# EAGLE schematic controller_board (EAGLE 9.6.2)
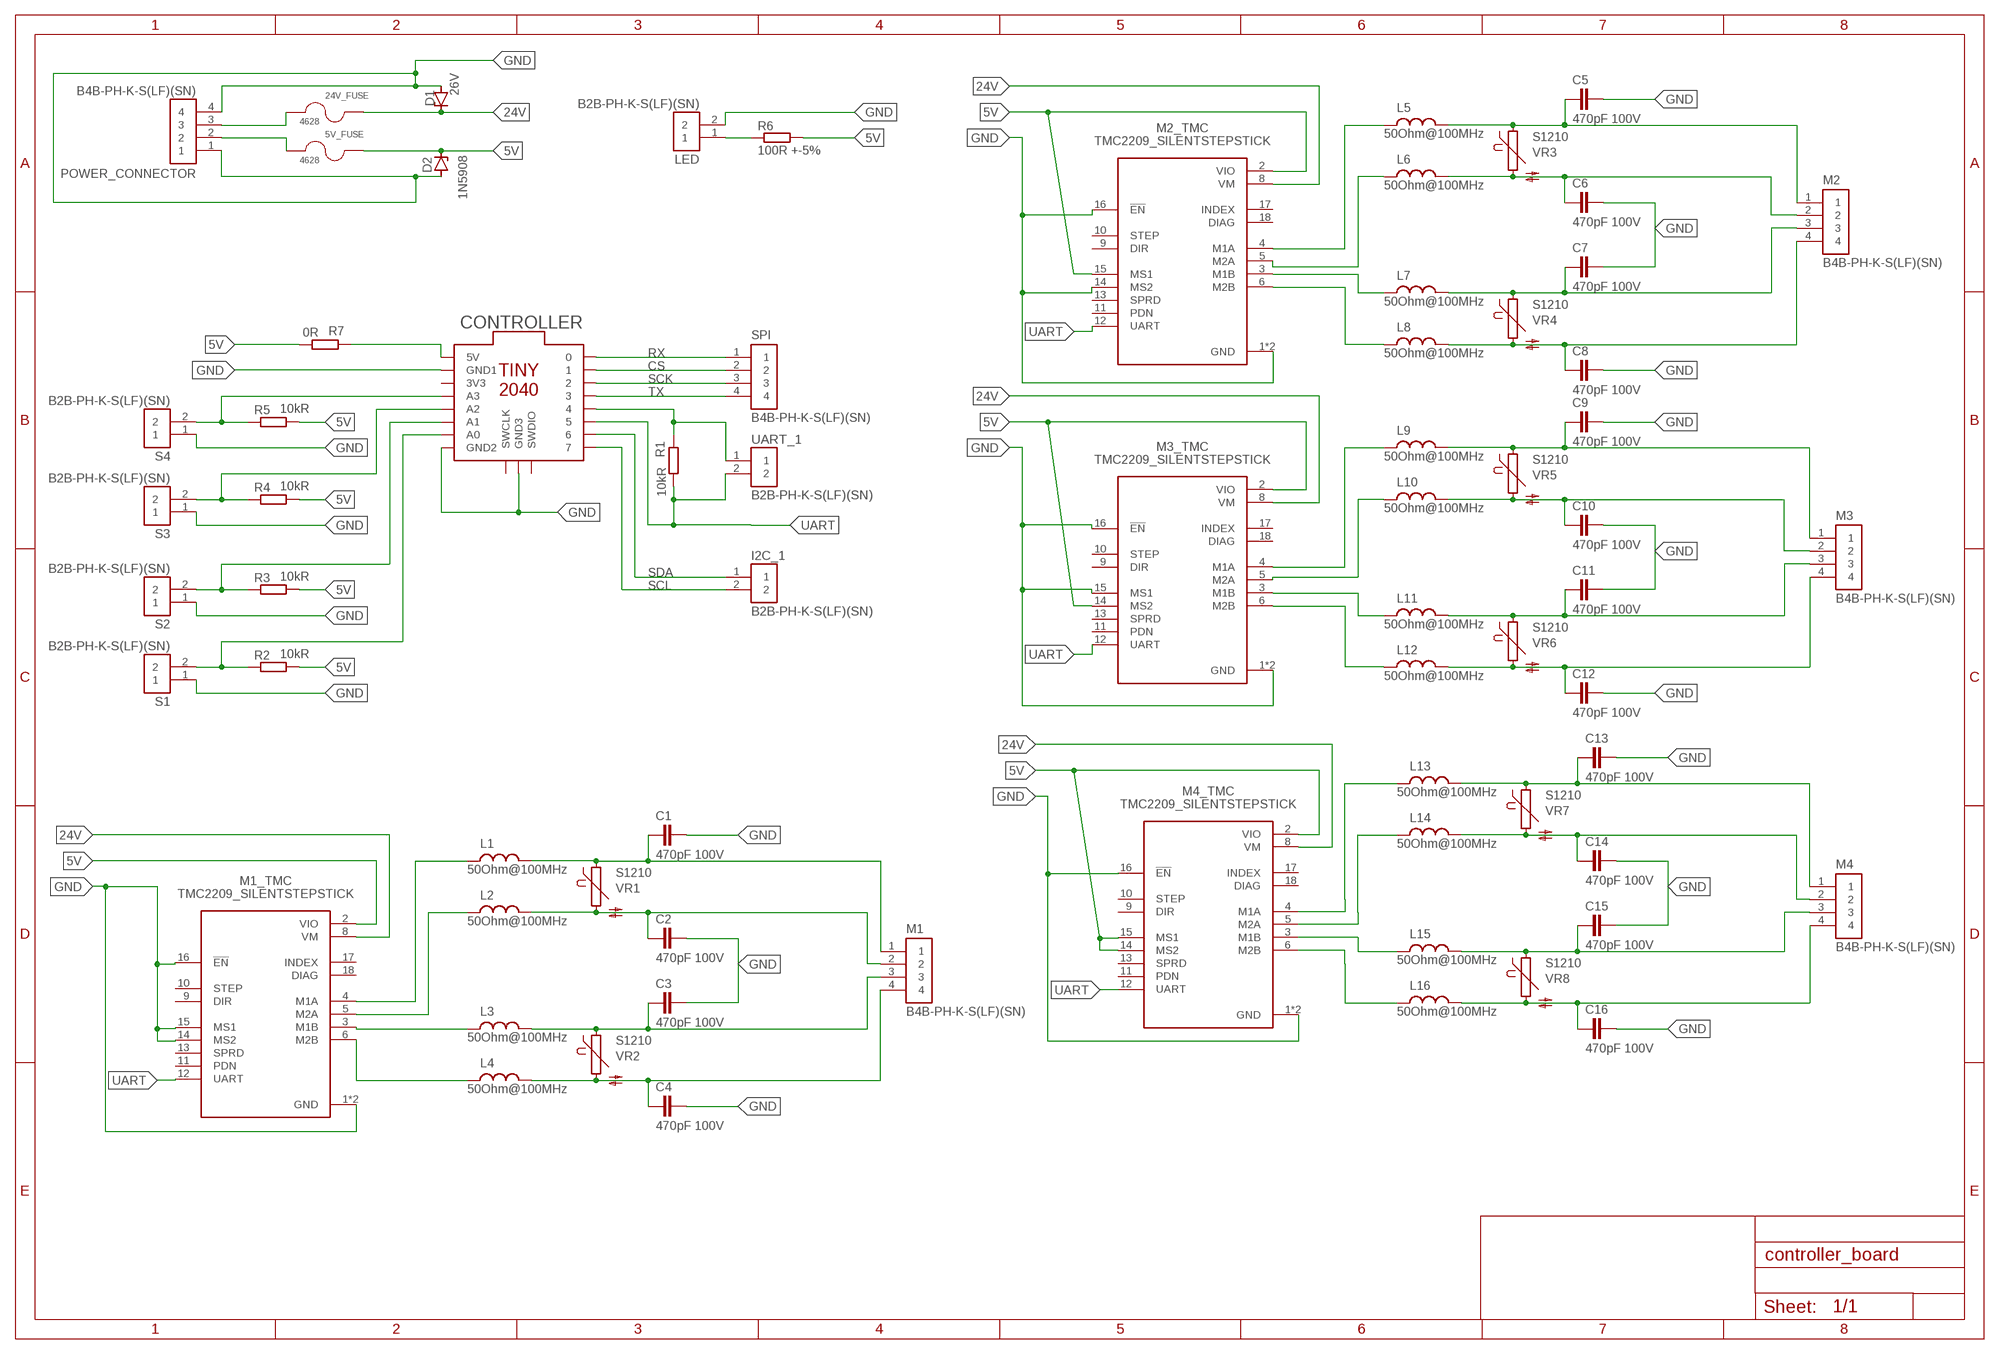
[diagram p0: schematic, sheet 1]

## Parts
5V_FUSE  4628  [FUSE_4628]
24V_FUSE  4628  [FUSE_4628]
C1  470pF 100V  C-EUC0402  [C0402]
C2  470pF 100V  C-EUC0402  [C0402]
C3  470pF 100V  C-EUC0402  [C0402]
C4  470pF 100V  C-EUC0402  [C0402]
C5  470pF 100V  C-EUC0402  [C0402]
C6  470pF 100V  C-EUC0402  [C0402]
C7  470pF 100V  C-EUC0402  [C0402]
C8  470pF 100V  C-EUC0402  [C0402]
C9  470pF 100V  C-EUC0402  [C0402]
C10  470pF 100V  C-EUC0402  [C0402]
C11  470pF 100V  C-EUC0402  [C0402]
C12  470pF 100V  C-EUC0402  [C0402]
C13  470pF 100V  C-EUC0402  [C0402]
C14  470pF 100V  C-EUC0402  [C0402]
C15  470pF 100V  C-EUC0402  [C0402]
C16  470pF 100V  C-EUC0402  [C0402]
CONTROLLER  TINY2040_HEADER  [TINY2040_HEADER]
D1  26V  ZENER-DIODESMB  [SMB]
D2  1N5908  ZENER-DIODESMB  [SMB]
I2C_1  B2B-PH-K-S(LF)(SN)  [JST_B2B-PH-K-S(LF)(SN)]
L1  50Ohm@100MHz  L  (no package)
L2  50Ohm@100MHz  L  (no package)
L3  50Ohm@100MHz  L  (no package)
L4  50Ohm@100MHz  L  (no package)
L5  50Ohm@100MHz  L  (no package)
L6  50Ohm@100MHz  L  (no package)
L7  50Ohm@100MHz  L  (no package)
L8  50Ohm@100MHz  L  (no package)
L9  50Ohm@100MHz  L  (no package)
L10  50Ohm@100MHz  L  (no package)
L11  50Ohm@100MHz  L  (no package)
L12  50Ohm@100MHz  L  (no package)
L13  50Ohm@100MHz  L  (no package)
L14  50Ohm@100MHz  L  (no package)
L15  50Ohm@100MHz  L  (no package)
L16  50Ohm@100MHz  L  (no package)
LED  B2B-PH-K-S(LF)(SN)  [JST_B2B-PH-K-S(LF)(SN)]
M1  B4B-PH-K-S(LF)(SN)  [JST_B4B-PH-K-S(LF)(SN)]
M1_TMC  TMC2209_SILENTSTEPSTICK  [MODULE_TMC2209_SILENTSTEPSTICK]
M2  B4B-PH-K-S(LF)(SN)  [JST_B4B-PH-K-S(LF)(SN)]
M2_TMC  TMC2209_SILENTSTEPSTICK  [MODULE_TMC2209_SILENTSTEPSTICK]
M3  B4B-PH-K-S(LF)(SN)  [JST_B4B-PH-K-S(LF)(SN)]
M3_TMC  TMC2209_SILENTSTEPSTICK  [MODULE_TMC2209_SILENTSTEPSTICK]
M4  B4B-PH-K-S(LF)(SN)  [JST_B4B-PH-K-S(LF)(SN)]
M4_TMC  TMC2209_SILENTSTEPSTICK  [MODULE_TMC2209_SILENTSTEPSTICK]
POWER_CONNECTOR  B4B-PH-K-S(LF)(SN)  [JST_B4B-PH-K-S(LF)(SN)]
R1  10kR  R-EU_R0805  [R0805]
R2  10kR  R-EU_R0805  [R0805]
R3  10kR  R-EU_R0805  [R0805]
R4  10kR  R-EU_R0805  [R0805]
R5  10kR  R-EU_R0805  [R0805]
R6  100R +-5%  R-EU_R0805  [R0805]
R7  0R  R-EU_R0805  [R0805]
S1  B2B-PH-K-S(LF)(SN)  [JST_B2B-PH-K-S(LF)(SN)]
S2  B2B-PH-K-S(LF)(SN)  [JST_B2B-PH-K-S(LF)(SN)]
S3  B2B-PH-K-S(LF)(SN)  [JST_B2B-PH-K-S(LF)(SN)]
S4  B2B-PH-K-S(LF)(SN)  [JST_B2B-PH-K-S(LF)(SN)]
SPI  B4B-PH-K-S(LF)(SN)  [JST_B4B-PH-K-S(LF)(SN)]
UART_1  B2B-PH-K-S(LF)(SN)  [JST_B2B-PH-K-S(LF)(SN)]
VR1  S1210  [S1210]
VR2  S1210  [S1210]
VR3  S1210  [S1210]
VR4  S1210  [S1210]
VR5  S1210  [S1210]
VR6  S1210  [S1210]
VR7  S1210  [S1210]
VR8  S1210  [S1210]

## Nets
5V: 5V_FUSE.2 D2.C M1_TMC.2(VIO) M2_TMC.2(VIO) M2_TMC.15(MS1) M3_TMC.2(VIO) M3_TMC.14(MS2) M4_TMC.2(VIO) M4_TMC.14(MS2) M4_TMC.15(MS1) R2.2 R3.2 R4.2 R5.2 R6.2 R7.2
24V: 24V_FUSE.2 D1.C M1_TMC.8(VM) M2_TMC.8(VM) M3_TMC.8(VM) M4_TMC.8(VM)
A0: CONTROLLER.A0 R2.1 S1.2
A1: CONTROLLER.A1 R3.1 S2.2
A2: CONTROLLER.A2 R4.1 S3.2
CS: CONTROLLER.1 SPI.2
GND: C1.1 C2.1 C3.1 C4.1 C5.1 C6.1 C7.1 C8.1 C9.1 C10.1 C11.1 C12.1 C13.1 C14.1 C15.1 C16.1 CONTROLLER.GND1 CONTROLLER.GND2 CONTROLLER.GND3 D1.A D2.A LED.2 M1_TMC.1(GND) M1_TMC.7(GND) M1_TMC.14(MS2) M1_TMC.15(MS1) M1_TMC.16(!EN) M2_TMC.1(GND) M2_TMC.7(GND) M2_TMC.14(MS2) M2_TMC.16(!EN) M3_TMC.1(GND) M3_TMC.7(GND) M3_TMC.15(MS1) M3_TMC.16(!EN) M4_TMC.1(GND) M4_TMC.7(GND) M4_TMC.16(!EN) POWER_CONNECTOR.1 POWER_CONNECTOR.4 S1.1 S2.1 S3.1 S4.1
N$1: C1.2 L1.2 M1.1 VR1.1
N$2: C2.2 L2.2 M1.2 VR1.2
N$3: C3.2 L3.2 M1.3 VR2.1
N$4: C4.2 L4.2 M1.4 VR2.2
N$5: C5.2 L5.2 M2.1 VR3.1
N$6: C6.2 L6.2 M2.2 VR3.2
N$7: C7.2 L7.2 M2.3 VR4.1
N$8: C8.2 L8.2 M2.4 VR4.2
N$9: C9.2 L9.2 M3.1 VR5.1
N$10: C10.2 L10.2 M3.2 VR5.2
N$11: C11.2 L11.2 M3.3 VR6.1
N$12: C12.2 L12.2 M3.4 VR6.2
N$13: L9.1 M3_TMC.4(M1A)
N$14: L10.1 M3_TMC.5(M2A)
N$15: L12.1 M3_TMC.6(M2B)
N$16: L11.1 M3_TMC.3(M1B)
N$17: LED.1 R6.1
N$18: CONTROLLER.5V R7.1
N$19: L2.1 M1_TMC.5(M2A)
N$20: CONTROLLER.4 R1.1 UART_1.1
N$21: L3.1 M1_TMC.3(M1B)
N$22: L1.1 M1_TMC.4(M1A)
N$23: 5V_FUSE.1 POWER_CONNECTOR.2
N$24: CONTROLLER.A3 R5.1 S4.2
N$25: 24V_FUSE.1 POWER_CONNECTOR.3
N$26: L4.1 M1_TMC.6(M2B)
N$28: L5.1 M2_TMC.4(M1A)
N$29: L6.1 M2_TMC.5(M2A)
N$30: L8.1 M2_TMC.6(M2B)
N$31: L7.1 M2_TMC.3(M1B)
N$32: C13.2 L13.2 M4.1 VR7.1
N$33: C14.2 L14.2 M4.2 VR7.2
N$34: C15.2 L15.2 M4.3 VR8.1
N$35: C16.2 L16.2 M4.4 VR8.2
N$36: L13.1 M4_TMC.4(M1A)
N$37: L14.1 M4_TMC.5(M2A)
N$38: L16.1 M4_TMC.6(M2B)
N$39: L15.1 M4_TMC.3(M1B)
RX: CONTROLLER.0 SPI.1
SCK: CONTROLLER.2 SPI.3
SCL: CONTROLLER.7 I2C_1.2
SDA: CONTROLLER.6 I2C_1.1
TX: CONTROLLER.3 SPI.4
UART: CONTROLLER.5 M1_TMC.12(UART) M2_TMC.12(UART) M3_TMC.12(UART) M4_TMC.12(UART) R1.2 UART_1.2
Unconnected: CONTROLLER.3V3 CONTROLLER.SWCLK CONTROLLER.SWDIO M1_TMC.9(DIR) M1_TMC.10(STEP) M1_TMC.11(PDN) M1_TMC.13(SPRD) M1_TMC.17(INDEX) M1_TMC.18(DIAG) M2_TMC.9(DIR) M2_TMC.10(STEP) M2_TMC.11(PDN) M2_TMC.13(SPRD) M2_TMC.17(INDEX) M2_TMC.18(DIAG) M3_TMC.9(DIR) M3_TMC.10(STEP) M3_TMC.11(PDN) M3_TMC.13(SPRD) M3_TMC.17(INDEX) M3_TMC.18(DIAG) M4_TMC.9(DIR) M4_TMC.10(STEP) M4_TMC.11(PDN) M4_TMC.13(SPRD) M4_TMC.17(INDEX) M4_TMC.18(DIAG)

## Library data of the parts
5V_FUSE 24V_FUSE = 4628:4628: Check availability <https://pricing.snapeda.com/parts/4628/Keystone/view-part?ref=eda>; AVAILABILITY: In Stock; DESCRIPTION: 5mm Slim Line Fuse holder; MF: Keystone; MP: 4628; PACKAGE: None; PRICE: None; PURCHASE-URL: https://pricing.snapeda.com/search?q=4628&ref=eda
C1-C16 = rcl:C-EU: CAPACITOR, European symbol; SPICEPREFIX: C
CONTROLLER = tiny2040_headerd:TINY2040_HEADER
D1 D2 = diode:ZENER-DIODE: Z-Diode
I2C_1 LED S1-S4 UART_1 = B2B-PH-K-S_LF__SN_:B2B-PH-K-S(LF)(SN): PH Series 2 Position 2 mm Pitch Through Hole Top Entry Shrouded Header Check availability <https://pricing.snapeda.com/parts/B2B-PH-K-S%20%28LF%29%28SN%29/JST/view-part?ref=eda>; AVAILABILITY: In Stock; DESCRIPTION: Connector Header Through Hole 2 position 0.079 (2.00mm); MF: JST; MP: B2B-PH-K-S (LF)(SN); PACKAGE: None; PRICE: None
L1-L16 = ngspice-simulation:L: INDUCTOR
M1-M4 POWER_CONNECTOR SPI = B4B-PH-K-S_LF__SN_:B4B-PH-K-S(LF)(SN): PH Series 4 Position 2 mm Pitch Through Hole Crimp Top Entry Shrouded Header Check availability <https://pricing.snapeda.com/parts/B4B-PH-K-S%28LF%29%28SN%29/JST%20Sales/view-part?ref=eda>; AVAILABILITY: In Stock; DESCRIPTION: Connector Header Through Hole 4 position 0.079 (2.00mm); MF: JST Sales; MP: B4B-PH-K-S(LF)(SN); PACKAGE: None; PRICE: None
M1_TMC M2_TMC M3_TMC M4_TMC = TMC2209_SILENTSTEPSTICK:TMC2209_SILENTSTEPSTICK: Check availability <https://pricing.snapeda.com/parts/TMC2209%20SILENTSTEPSTICK/Trinamic%20Motion%20Control%20GmbH/view-part?ref=eda>; AVAILABILITY: In Stock; DESCRIPTION: TMC2209 Motor Controller/Driver Power Management Evaluation Board; MF: Trinamic Motion Control GmbH; MP: TMC2209 SILENTSTEPSTICK; PACKAGE: None; PRICE: None; PURCHASE-URL: https://pricing.snapeda.com/search?q=TMC2209 SILENTSTEPSTICK&ref=eda
R1-R7 = rcl:R-EU_: RESISTOR, European symbol; SPICEPREFIX: R
VR1-VR8 = varistor:S1210: VARISTOR